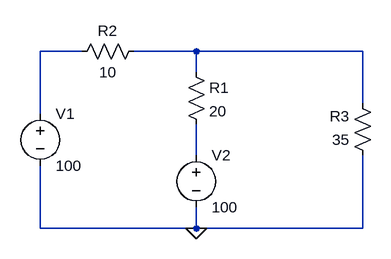
[diagram p0: schematic picture_1.1.asc]
picture_1.1.asc, the LTspice schematic file:
Version 4.1
SHEET 1 880 680
WIRE 48 48 -16 48
WIRE 224 48 128 48
WIRE 480 48 224 48
WIRE 224 80 224 48
WIRE 480 128 480 48
WIRE -16 144 -16 48
WIRE 224 208 224 160
WIRE -16 320 -16 224
WIRE 224 320 224 288
WIRE 224 320 -16 320
WIRE 480 320 480 208
WIRE 480 320 224 320
FLAG 224 320 0
SYMBOL voltage -16 128 R0
WINDOW 123 0 0 Left 0
WINDOW 39 0 0 Left 0
SYMATTR InstName V1
SYMATTR Value 100
SYMBOL voltage 224 192 R0
WINDOW 123 0 0 Left 0
WINDOW 39 0 0 Left 0
SYMATTR InstName V2
SYMATTR Value 100
SYMBOL res 208 64 R0
SYMATTR InstName R1
SYMATTR Value 20
SYMBOL res 144 32 R90
WINDOW 0 0 56 VBottom 2
WINDOW 3 32 56 VTop 2
SYMATTR InstName R2
SYMATTR Value 10
SYMBOL res 496 224 R180
WINDOW 0 36 76 Left 2
WINDOW 3 36 40 Left 2
SYMATTR InstName R3
SYMATTR Value 35

The netlist it stands for:
* picture_1.1.asc
V1 N001 0 100
V2 N003 0 100
R1 N002 N003 20
R2 N002 N001 10
R3 0 N002 35
.backanno
.end